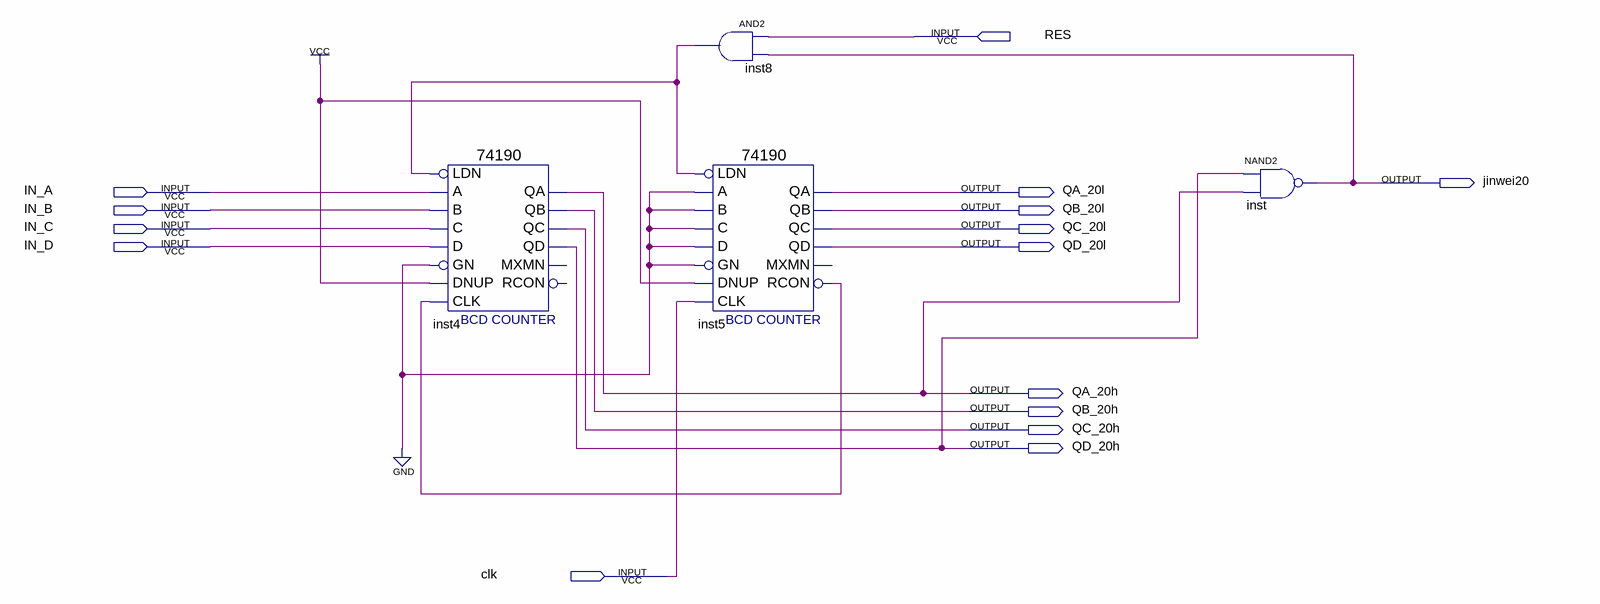
[diagram p0: schematic sheet]
// Quartus schematic jianfa20.bdf as structural Verilog: 4 symbols, 15 pins
module jianfa20 (
  input  RES,
  input  IN_A,
  input  IN_B,
  input  IN_C,
  input  IN_D,
  input  clk,
  output jinwei20,
  output QA_20l,
  output QB_20l,
  output QC_20l,
  output QD_20l,
  output QA_20h,
  output QB_20h,
  output QC_20h,
  output QD_20h
);

  wire inst5_rcon, inst8_out;

  \74190  inst4 (
    .LDN(inst8_out), .A(IN_A), .C(IN_C), .B(IN_B), .D(IN_D), .GN(1'b0), .CLK(inst5_rcon), .DNUP(1'b1),
    .QA(QA_20h), .QB(QB_20h), .QD(QD_20h), .QC(QC_20h));  // open: MXMN, RCON
  and inst8 (inst8_out, RES, jinwei20);
  \74190  inst5 (
    .LDN(inst8_out), .A(1'b0), .C(1'b0), .B(1'b0), .D(1'b0), .GN(1'b0), .CLK(clk), .DNUP(1'b1), .QA(QA_20l),
    .QB(QB_20l), .QD(QD_20l), .QC(QC_20l), .RCON(inst5_rcon));  // open: MXMN
  nand inst (jinwei20, QD_20h, QA_20h);
endmodule
